# Altium schematic sheet [03] - POWER.SchDoc
size A3; DocumentNumber: 4; SheetNumber: 3; SheetTotal: 10
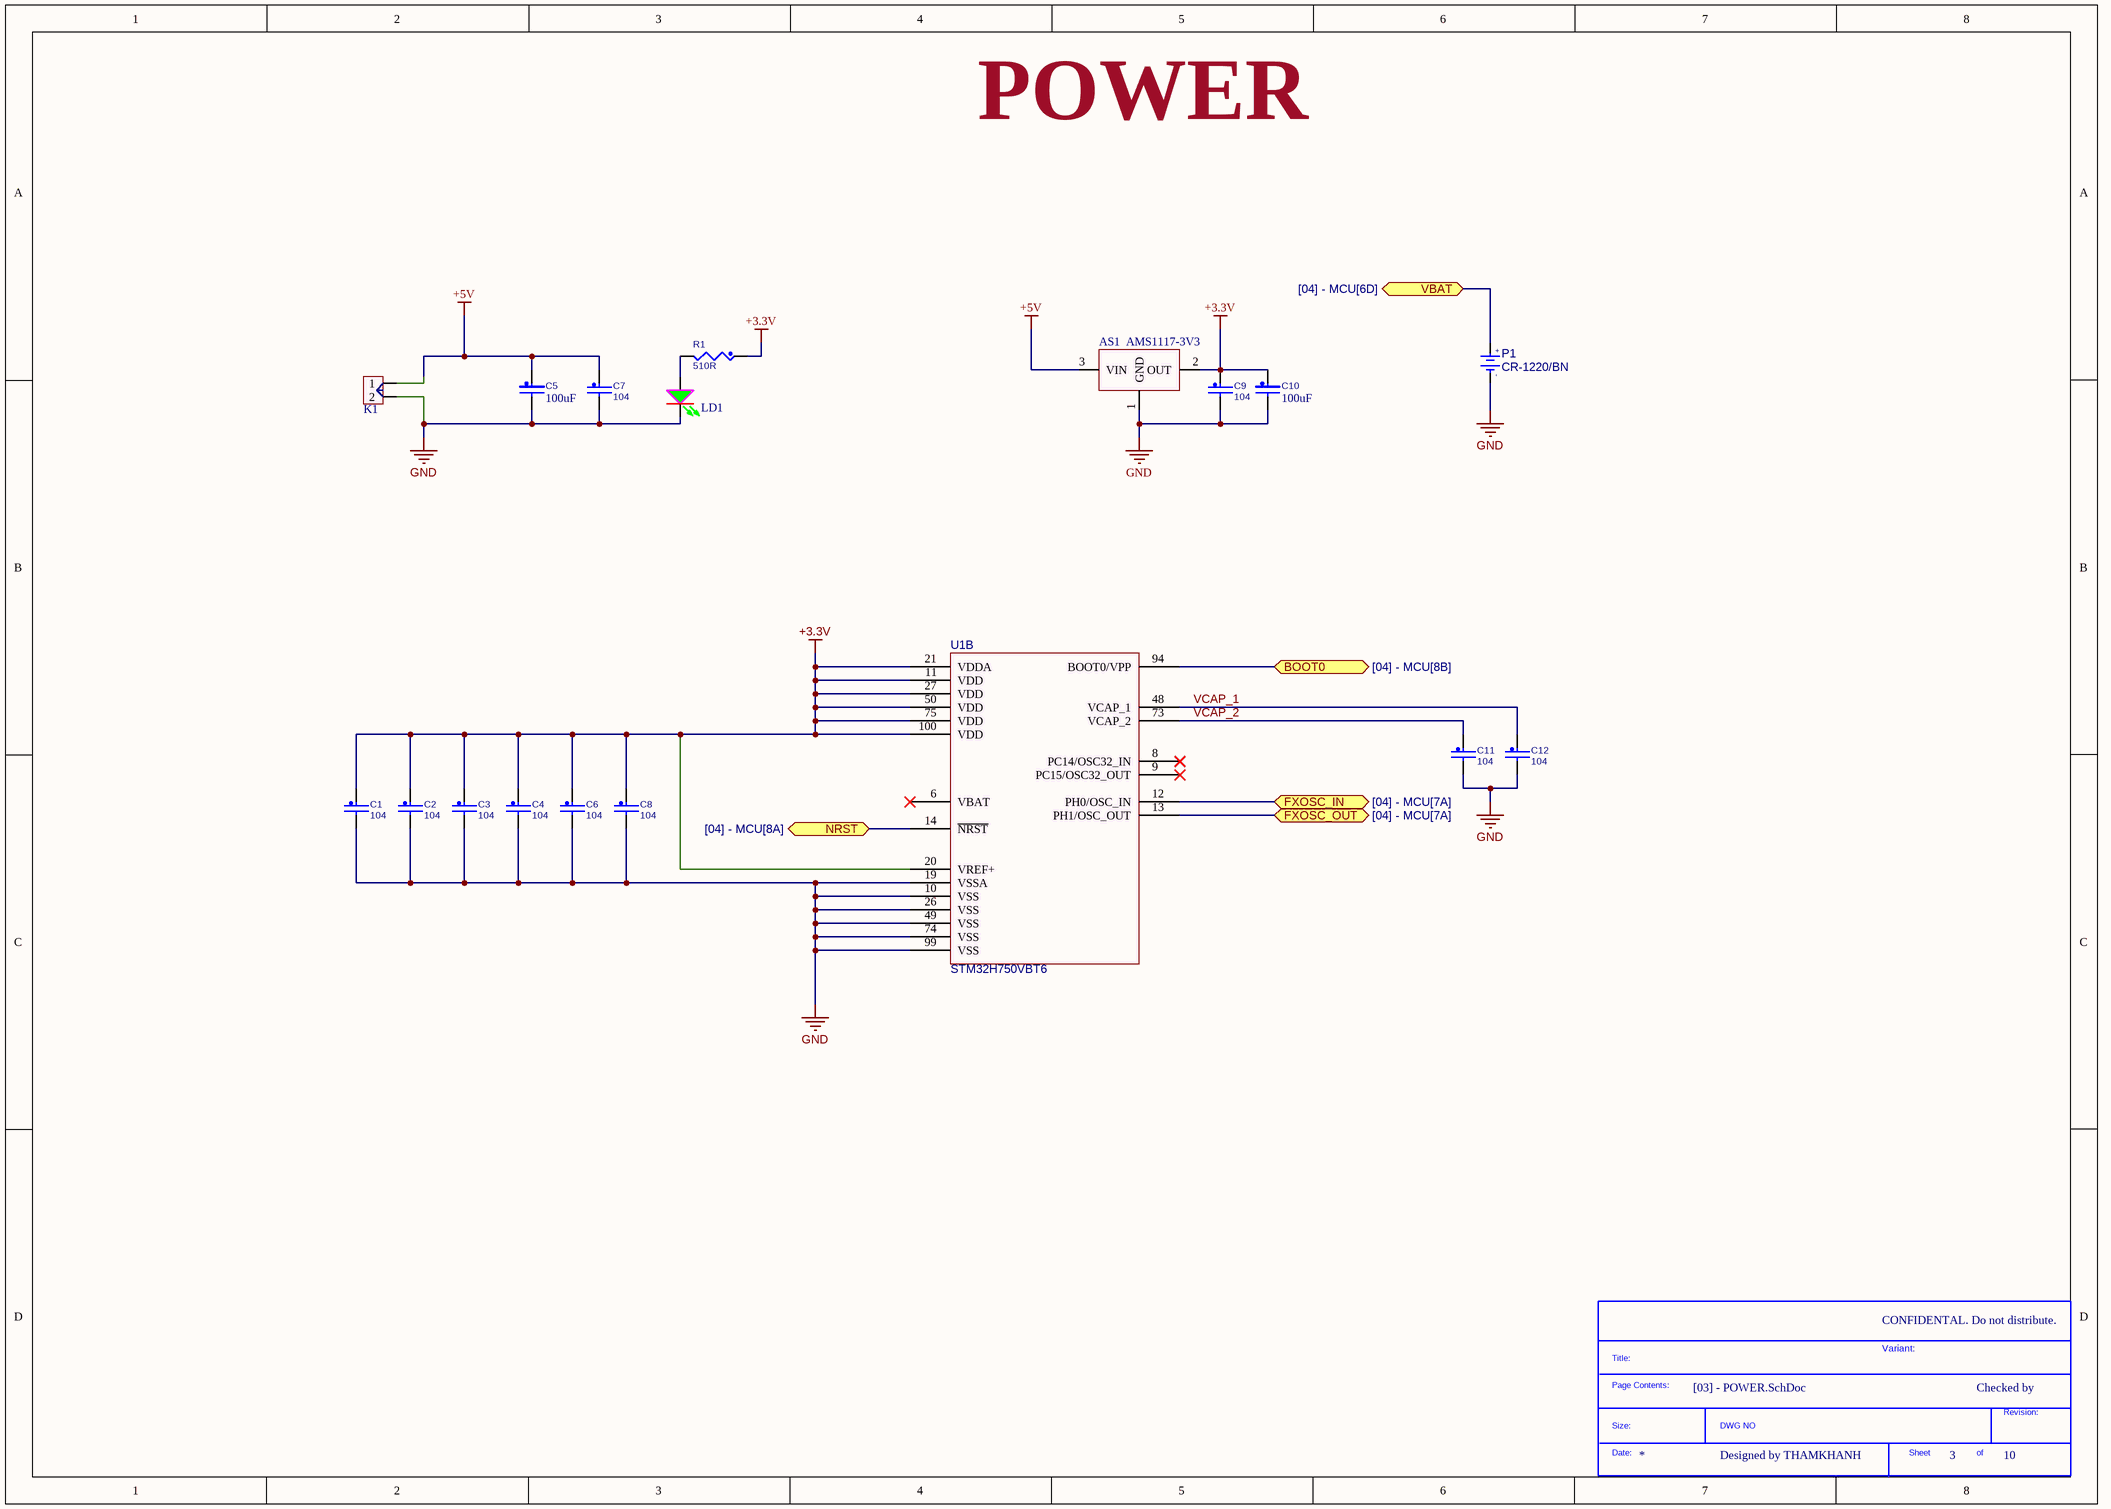
[diagram p0: [03] - POWER.SchDoc]

## Parts
*?  SDTitleBlock  (value not drawn)  (graphical)
AS1  AMS1117-3V3  [SOT223-BCE]
C1  104  [C0603]
C2  104  [C0603]
C3  104  [C0603]
C4  104  [C0603]
C5  100uF  [CAP-TAN-SMD-3530]
C6  104  [C0603]
C7  104  [C0603]
C8  104  [C0603]
C9  104  [C0603]
C10  100uF  [CAP-TAN-SMD-3530]
C11  104  [C0603]
C12  104  [C0603]
K1  KF2  [KF5.08 2DV]  (value not drawn)
LD1  LED SMD  [LED 0805/2012 BLUE]  (value not drawn)
P1  CR-1220/BN  [PIN-CR1220-SMD-NO]
R1  510R  [R0603]
U1  STM32H750VBT6  [QFP50P1400X1400-100N]  (part B of 3)

## Ports
BOOT0 (bidir, see [04] - MCU[8B]), FXOSC_IN (bidir, see [04] - MCU[7A]), FXOSC_OUT (bidir, see [04] - MCU[7A]), NRST (bidir, see [04] - MCU[8A]), VBAT (bidir, see [04] - MCU[6D])

## Nets
+3.3V: AS1.2(OUT) C1.1 C2.1 C3.1 C4.1 C6.1 C8.1 C9.1 C10.1 R1.1 U1.11(VDD) U1.20(VREF+) U1.21(VDDA) U1.27(VDD) U1.50(VDD) U1.75(VDD) U1.100(VDD)
+5V: AS1.3(VIN) C5.1 C7.1 K1.1
GND: AS1.1(GND) C1.2 C2.2 C3.2 C4.2 C5.2 C6.2 C7.2 C8.2 C9.2 C10.2 C11.2 C12.2 K1.2 LD1.2(K) P1.2(GND) U1.10(VSS) U1.19(VSSA) U1.26(VSS) U1.49(VSS) U1.74(VSS) U1.99(VSS)
BOOT0: U1.94(BOOT0/VPP) ; port BOOT0
FXOSC_IN: U1.12(PH0/OSC_IN) ; port FXOSC_IN
FXOSC_OUT: U1.13(PH1/OSC_OUT) ; port FXOSC_OUT
NRST: U1.14(~{NRST}) ; port NRST
VBAT: P1.1(+3V) ; port VBAT
VCAP_1: C12.1 U1.48(VCAP_1)
VCAP_2: C11.1 U1.73(VCAP_2)
NetLD1_1: LD1.1(A) R1.2

Not connected (* = marked no-connect by the designer): U1 6(VBAT)* 8(PC14/OSC32_IN)* 9(PC15/OSC32_OUT)*

## Notes on the sheet
- POWER
- CONFIDENTAL. Do not distribute.
- Variant:
- Checked by
- Designed by THAMKHANH
- (in symbol PIN-CR-1220/BN) +; -
- (in symbol SDTitleBlock) Title:; Page Contents:; Revision:; Size:; DWG NO; Date:; Sheet; of

## Library data of the parts
AS1 = AMS1117-3V3: 800mA Low-Dropout Linear Regulator
C1-C4 C6-C9 C11 C12 = CAP-SMD-CERAMIC: Surface Mound Multilayer Ceramic Chip Capacitor (SMD MLCC); Manufacturer: TDK Corporation; Manufacturer Part Number: C2012X5R1C226K; Capacitance: 22pF; Voltage - Rated: 16V; Tolerance: ±10%; Temperature Coefficient: X5R; .Checked PCB: RF; RoHS: RoHS Compliant; Category: Capacitors; Mounting Type: Surface Mount, MLCC; Operating Temperature: -55°C ~ 85°C; Applications: General Purpose; Ratings: -; Package / Case: 0805 (2012 Metric); Size / Dimension: 0.079" L x 0.049" W (2.00mm x 1.25mm); Height - Seated (Max): -; Thickness (Max): 0.057" (1.45mm); Lead Spacing: -; Features: -; Packaging: Cut Tape (CT); Lead Style: -; ComponentLink1URL: http://www.tdk.com/pdf/general_B11.pdf; ComponentLink1Description: http://www.tdk.com/pdf/general_B11.pdf; .Checked SCH: RF
C5 C10 = CAP-SMD-TANTALUM: Tantalum capacitor , T491A475K016AT, KEMET; Manufacturer Part Number: T491A105K016AT; Capacitance: 1uF; Tolerance: 20%; Voltage Rating: 16V; ESR (Equivalent Series Resistance): 10R; Leakage Current: 500nA; Polarity: Polar; Dissipation Factor: 4%; Life (Hours): 2000Hour; Ripple Current: 87mA; Manufacturer: KEMET; Mount: Surface Mount,PCB; Case/Package: 1206; Number of Pins: 2; Case Code (Imperial): 1206; Case Code (Metric): 3216; Dielectric Material: Tantalum; Min Operating Temperature: -55°C; Max Operating Temperature: 125°C; Packaging: Tape and Reel; Package Quantity: 1; Voltage Rating (DC): 16V; Termination: SMD/SMT; Voltage: 16V; Features: General Purpose; Length: 3.2mm; Height: 1.6mm; Width: 1.6mm; Height - Seated (Max): 0.071inch; Depth: 1.6mm; REACH SVHC: No SVHC; Lead Free: Lead Free; ComponentLink1URL: https://4donline.ihs.com/images/VipMasterIC/IC/KEME/KEME-S-A0006487387/KEME-S-A0006487387-1.pdf?hkey=52A5661711E402568146F3353EA87419&src-supplier=Element14; ComponentLink1Description: https://4donline.ihs.com/images/VipMasterIC/IC/KEME/KEME-S-A0006487387/KEME-S-A0006487387-1.pdf?hkey=52A5661711E402568146F3353EA87419&src-supplier=Element14; ComponentLink2URL: http://www.rapidonline.com/pdf/458280_da_en_01.pdf?src-supplier=Rapid+Electronics; ComponentLink2Description: http://www.rapidonline.com/pdf/458280_da_en_01.pdf?src-supplier=Rapid+Electronics; ComponentLink3URL: http://www.jameco.com/Jameco/Products/ProdDS/1573169.pdf?src-supplier=Jameco; ComponentLink3Description: http://www.jameco.com/Jameco/Products/ProdDS/1573169.pdf?src-supplier=Jameco; ComponentLink4URL: http://www.kemet.com/kemet/web/homepage/kechome.nsf/file/T491%20Series/$file/KEM_T2005_T491.pdf?src-supplier=Farnell; ComponentLink4Description: http://www.kemet.com/kemet/web/homepage/kechome.nsf/file/T491%20Series/$file/KEM_T2005_T491.pdf?src-supplier=Farnell; ComponentLink5URL: http://www.mouser.com/ds/2/212/KEM_T2005_T491-1093550.pdf?src-supplier=Mouser; ComponentLink5Description: http://www.mouser.com/ds/2/212/KEM_T2005_T491-1093550.pdf?src-supplier=Mouser; ComponentLink6URL: https://www.distrelec.biz/Web/Downloads/_t/ds/KEM_T2005_T491_eng_tds.pdf?mime=application%2Fpdf&src-supplier=Distrelec; ComponentLink6Description: https://www.distrelec.biz/Web/Downloads/_t/ds/KEM_T2005_T491_eng_tds.pdf?mime=application%2Fpdf&src-supplier=Distrelec; ComponentLink7URL: https://api.kemet.com/component-edge/download/datasheet/T491A105K016AT.pdf?src-supplier=Digi-Key; ComponentLink7Description: https://api.kemet.com/component-edge/download/datasheet/T491A105K016AT.pdf?src-supplier=Digi-Key; ComponentLink8URL: http://www.kemet.com/kemet/web/homepage/kechome.nsf/file/T491%20Series/$file/KEM_T2005_T491.pdf?src-supplier=Element14; ComponentLink8Description: http://www.kemet.com/kemet/web/homepage/kechome.nsf/file/T491%20Series/$file/KEM_T2005_T491.pdf?src-supplier=Element14; ComponentLink9URL: http://uk.rs-online.com/webdocs/1529/0900766b815290c9.pdf?src-supplier=RSComponents; ComponentLink9Description: http://uk.rs-online.com/webdocs/1529/0900766b815290c9.pdf?src-supplier=RSComponents; ComponentLink10URL: https://www.alliedelec.com/m/d/1172a60f7bb3eb66344f86e8fb9ddbde.pdf?src-supplier=Allied+Electronics; ComponentLink10Description: https://www.alliedelec.com/m/d/1172a60f7bb3eb66344f86e8fb9ddbde.pdf?src-supplier=Allied+Electronics; Radiation Hardening: No; ComponentLink11URL: https://api.kemet.com/component-edge/download/datasheet/T491A475K016AT.pdf?src-supplier=Digi-Key; ComponentLink11Description: https://api.kemet.com/component-edge/download/datasheet/T491A475K016AT.pdf?src-supplier=Digi-Key; ComponentLink12URL: http://www.jameco.com/Jameco/Products/ProdDS/1573425.pdf?src-supplier=Jameco; ComponentLink12Description: http://www.jameco.com/Jameco/Products/ProdDS/1573425.pdf?src-supplier=Jameco; ComponentLink13URL: http://uk.rs-online.com/webdocs/1515/0900766b81515525.pdf?src-supplier=RSComponents; ComponentLink13Description: http://uk.rs-online.com/webdocs/1515/0900766b81515525.pdf?src-supplier=RSComponents; ComponentLink14URL: http://www.farnell.com/datasheets/1854511.pdf?src-supplier=Element14; ComponentLink14Description: http://www.farnell.com/datasheets/1854511.pdf?src-supplier=Element14; ComponentLink15URL: http://www.rapidonline.com/pdf/458253_da_en_01.pdf?src-supplier=Rapid+Electronics; ComponentLink15Description: http://www.rapidonline.com/pdf/458253_da_en_01.pdf?src-supplier=Rapid+Electronics; ComponentLink16URL: https://produktinfo.conrad.com/datenblaetter/450000-474999/458253-da-01-en-TANTAL_KONDENSATOR_T491A475K016AT.pdf?src-supplier=Conrad; ComponentLink16Description: https://produktinfo.conrad.com/datenblaetter/450000-474999/458253-da-01-en-TANTAL_KONDENSATOR_T491A475K016AT.pdf?src-supplier=Conrad
K1 = KF2: KF2, 5.08mm, 10A, 300V, -40C ~ 105C
LD1 = LED SMD: LED DIFFUSED SMD
P1 = PIN-CR-1220/BN: PANASONIC - CR-1220/BN - BATTERY, LITHIUM, CR1220; Capacity: 35mAh; Voltage Rating (DC): 3V; Outside Diameter: 12.5mm; Manufacturer: Panasonic; Manufacturer Part Number: CR-1220/BN; Weight: 1.2g; Min Operating Temperature: -30°C; Max Operating Temperature: 60°C; Chemistry/Technology: Lithium; Termination: Standard; Diameter: 12.5mm; Height: 2mm; Lead Free: Lead Free; REACH SVHC: Yes; ComponentLink1URL: http://uk.rs-online.com/webdocs/0c85/0900766b80c85259.pdf?src-supplier=RSComponents; ComponentLink1Description: http://uk.rs-online.com/webdocs/0c85/0900766b80c85259.pdf?src-supplier=RSComponents
R1 = RES-SMD: RES 0R OHM 1/8W 1% SMD; Manufacturer: Yageo; Manufacturer Part Number: RC0402FR-0749R9L; Power (Watts): 0.063W, 1/16W; .Checked PCB: used; Temperature Coefficient: ±100ppm/°C; Resistance: 3.3kR; Power Rating: 125mW; Voltage Rating: 100V; Category: Resistors; Supplier Part Number: 311-49.9LRCT-ND; Package / Case: 0402 (1005 Metric); Price 1k [$]: 0.01421; Tolerance: ±1%; Value: 0R; .Checked SCH: used; Supplier: Digikey; RoHS: RoHS Compliant; Composition: Thick Film; Features: -; Size / Dimension: 0.039" L x 0.020" W (1.00mm x 0.50mm); Height: 0.016" (0.40mm); Number of Terminations: 2; Packaging: Cut Tape (CT); ComponentLink1URL: http://www.yageo.com/documents/recent/PYu-RC0402_51_RoHS_L_6.pdf; ComponentLink1Description: http://www.yageo.com/documents/recent/PYu-RC0402_51_RoHS_L_6.pdf; Resistance (Ohms): 0R; Mount: Surface Mount; Case/Package: 0805; Number of Pins: 2; Contact Plating: Tin; Case Code (Metric): 2012; Case Code (Imperial): 0805; Min Operating Temperature: -55°C; Max Operating Temperature: 155°C; Package Quantity: 1; Termination: SMD/SMT; Military Standard: Not; Max Power Dissipation: 125mW; Voltage Rating (DC): 100V; Length: 2mm; Width: 1.25mm; Depth: 1.25mm; Radiation Hardening: No; REACH SVHC: No SVHC; Lead Free: Lead Free; ComponentLink2URL: http://www.farnell.com/datasheets/485442.pdf?src-supplier=Farnell; ComponentLink2Description: http://www.farnell.com/datasheets/485442.pdf?src-supplier=Farnell; ComponentLink3URL: http://uk.rs-online.com/webdocs/0bee/0900766b80beefcc.pdf?src-supplier=RSComponents; ComponentLink3Description: http://uk.rs-online.com/webdocs/0bee/0900766b80beefcc.pdf?src-supplier=RSComponents; ComponentLink4URL: http://industrial.panasonic.com/www-data/pdf/AOA0000/AOA0000CE26.pdf?src-supplier=Future+Electronics; ComponentLink4Description: http://industrial.panasonic.com/www-data/pdf/AOA0000/AOA0000CE26.pdf?src-supplier=Future+Electronics; ComponentLink5URL: https://www.alliedelec.com/m/d/b6b0537e86f421aa7f5975bb1d8f429a.pdf?src-supplier=Allied+Electronics; ComponentLink5Description: https://www.alliedelec.com/m/d/b6b0537e86f421aa7f5975bb1d8f429a.pdf?src-supplier=Allied+Electronics; ComponentLink6URL: http://industrial.panasonic.com/www-data/pdf/AOA0000/AOA0000CE26.pdf?src-supplier=Avnet; ComponentLink6Description: http://industrial.panasonic.com/www-data/pdf/AOA0000/AOA0000CE26.pdf?src-supplier=Avnet; ComponentLink7URL: http://industrial.panasonic.com/www-data/pdf/AOA0000/AOA0000CE26.pdf?src-supplier=Avnet+Europe; ComponentLink7Description: http://industrial.panasonic.com/www-data/pdf/AOA0000/AOA0000CE26.pdf?src-supplier=Avnet+Europe; ComponentLink8URL: http://industrial.panasonic.com/cdbs/www-data/pdf/RDM0000/AOA0000C307.pdf?src-supplier=Farnell; ComponentLink8Description: http://industrial.panasonic.com/cdbs/www-data/pdf/RDM0000/AOA0000C307.pdf?src-supplier=Farnell; ComponentLink9URL: https://www.distrelec.biz/Web/Downloads/_t/ds/ERA_eng_tds.pdf?mime=application%2Fpdf&src-supplier=Distrelec; ComponentLink9Description: https://www.distrelec.biz/Web/Downloads/_t/ds/ERA_eng_tds.pdf?mime=application%2Fpdf&src-supplier=Distrelec; ComponentLink10URL: http://www.farnell.com/datasheets/485442.pdf?src-supplier=Element14; ComponentLink10Description: http://www.farnell.com/datasheets/485442.pdf?src-supplier=Element14; ComponentLink11URL: http://www.farnell.com/datasheets/2052875.pdf?src-supplier=Farnell; ComponentLink11Description: http://www.farnell.com/datasheets/2052875.pdf?src-supplier=Farnell; ComponentLink12URL: http://www.farnell.com/datasheets/2059650.pdf?src-supplier=Farnell; ComponentLink12Description: http://www.farnell.com/datasheets/2059650.pdf?src-supplier=Farnell; ComponentLink13URL: https://produktinfo.conrad.com/datenblaetter/450000-474999/453184-da-01-en-WIDERSTAND_0805_ERA.pdf?src-supplier=Conrad; ComponentLink13Description: https://produktinfo.conrad.com/datenblaetter/450000-474999/453184-da-01-en-WIDERSTAND_0805_ERA.pdf?src-supplier=Conrad
U1 = STM32H750VBT6: STMICROELECTRONICS - STM32H750VBT6 - MCU, 32BIT, 400MHZ, LQFP-100; Interface: I2C,SPI,Ethernet,IrDA,MMC,SDIO,SD,UART,EBI/EMI; Peripherals: Brown-out Detect/Reset,POR,PWM,WDT,DMA,LCD; Memory Type: FLASH; Core Architecture: ARM; Frequency: 480MHz; Number of I/Os: 82; Memory Size: 128KB; Oscillator Type: Internal; Manufacturer: STMicroelectronics; Manufacturer Part Number: STM32H750VBT6; Mount: Surface Mount; Case/Package: LQFP; Min Operating Temperature: -40°C; Max Operating Temperature: 85°C; Packaging: Tray; ComponentLink1URL: http://www.farnell.com/datasheets/2710930.pdf?src-supplier=Farnell; ComponentLink1Description: http://www.farnell.com/datasheets/2710930.pdf?src-supplier=Farnell; ComponentLink2URL: https://www.st.com/resource/en/errata_sheet/dm00399555.pdf?src-supplier=Digi-Key; ComponentLink2Description: https://www.st.com/resource/en/errata_sheet/dm00399555.pdf?src-supplier=Digi-Key; ComponentLink3URL: http://www.farnell.com/datasheets/2710930.pdf?src-supplier=Element14; ComponentLink3Description: http://www.farnell.com/datasheets/2710930.pdf?src-supplier=Element14; ComponentLink4URL: http://www.farnell.com/datasheets/2710930.pdf?src-supplier=Newark; ComponentLink4Description: http://www.farnell.com/datasheets/2710930.pdf?src-supplier=Newark